# Altium schematic sheet Sam4S Power Distribution_5.SchDoc: Sam4S Power Distribution
size A4; DrawnBy: Mike Cusdin; Address1: ECE Department; Address2: University of Canterbury; Address3: Christchurch 8041; Address4: New Zealand; Revision: 2; SheetNumber: 2; SheetTotal: 2; PageSetup: Record=PageOptions|CenterHorizontal=True|CenterVertical=True|PrintScale=0.97|XCorrection=1.00|YCorrection=1.00|PrintKind=0|BorderSize=5000000|LeftOffset=0|BottomOffset=0|Orientation=2|PaperLength=1000|PaperWidth=1000|Scale=100|PaperSource=7|PrintQuality=-3|MediaType=1|DitherType=10|PrintScaleMode=1|PaperKind=A4 (210 x 297 mm)|PaperIndex=9
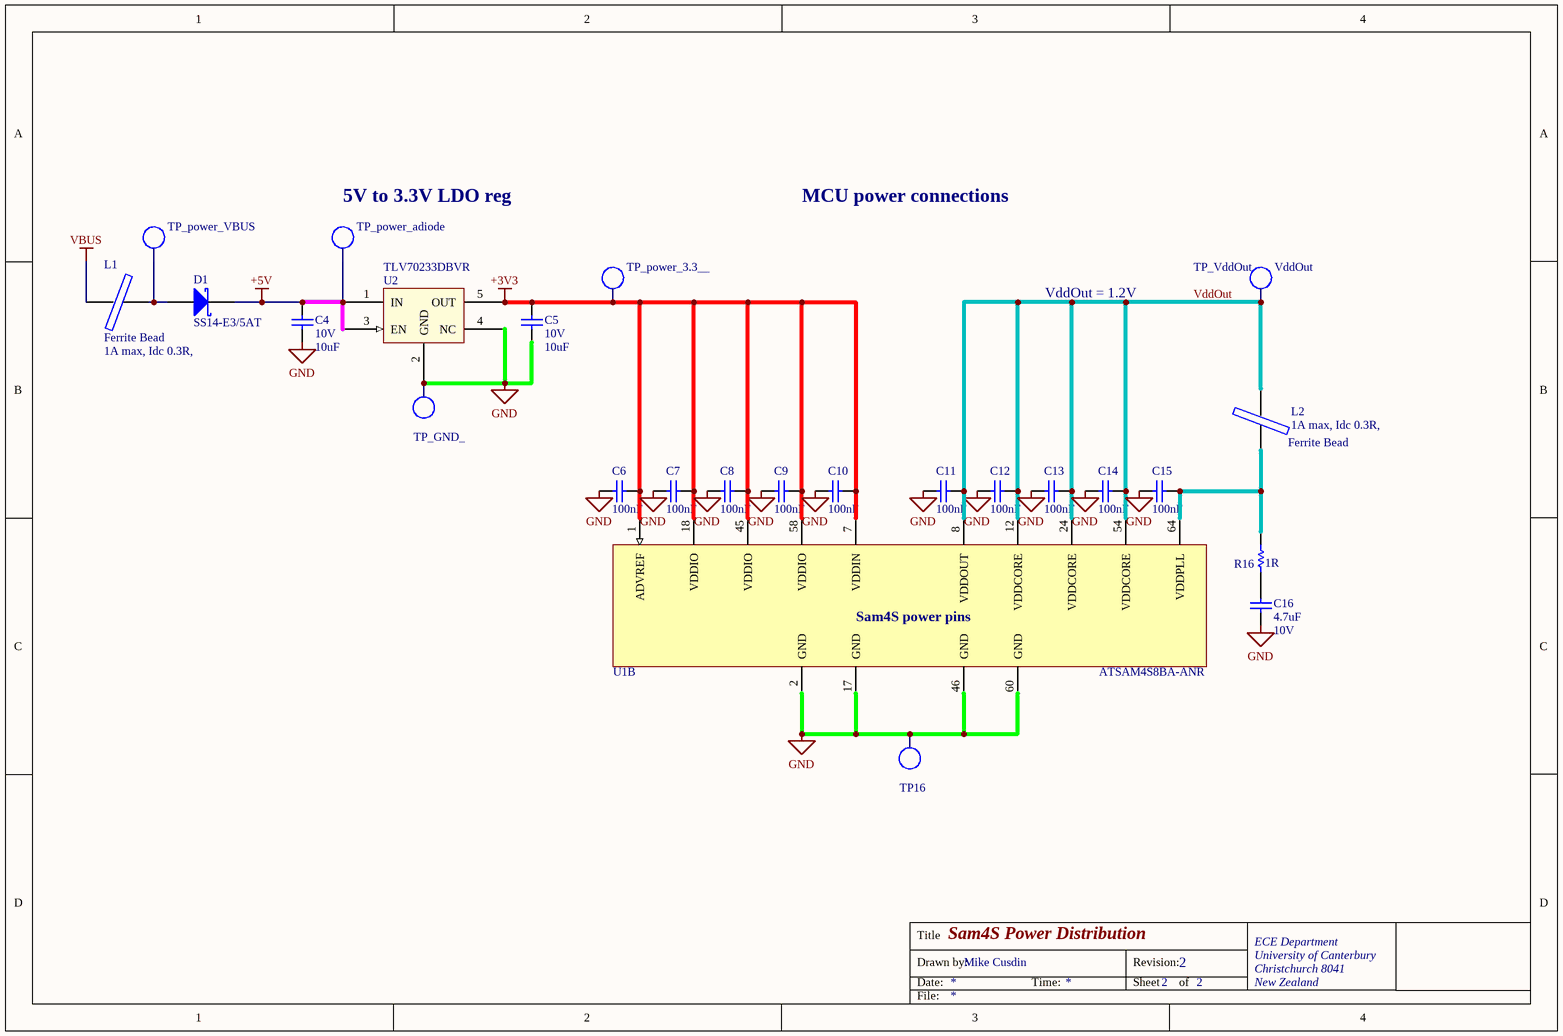
[diagram p0: Sam4S Power Distribution_5.SchDoc]

## Parts
C4  Voltage - Rated: 10V  [CAPC1608L]  (hidden comment: 10uF)
C5  Voltage - Rated: 10V  [CAPC1608L]  (hidden comment: 10uF)
C6  100nF  [CAPC1608L]
C7  100nF  [CAPC1608L]
C8  100nF  [CAPC1608L]
C9  100nF  [CAPC1608L]
C10  100nF  [CAPC1608L]
C11  100nF  [CAPC1608L]
C12  100nF  [CAPC1608L]
C13  100nF  [CAPC1608L]
C14  100nF  [CAPC1608L]
C15  100nF  [CAPC1608L]
C16  Max Voltage: 10V  [CAPC1608N]  (hidden comment: 4.7uF)
D1  SS14-E3/5AT  [DIOM4227X23N]
L1  Ferrite Bead  value 1A max, Idc 0.3R,  [INDC3216L]
L2  Ferrite Bead  value 1A max, Idc 0.3R,  [INDC3216L]
R16  1R  [RESC3216L]
TP16  Gnd  [TP_0805]  (value not drawn)
TP_GND_  Gnd  [TP_0805]  (value not drawn)
TP_power_3.3__  3V3  [TP_0805]  (value not drawn)
TP_power_adiode  3V3  [TP_0805]  (value not drawn)
TP_power_VBUS  3V3  [TP_0805]  (value not drawn)
TP_VddOut  VddOut  [TP_0805]
U1  ATSAM4S8BA-ANR  [LQFP64_L]  (part B of 2)
U2  TLV70233DBVR  [SOT95P280X145-5N]

## Nets
+3V3: C5.1 C6.2 C7.2 C8.2 C9.2 C10.2 TP_power_3.3__.1(TP) U1.1(ADVREF) U1.7(VDDIN) U1.18(VDDIO) U1.45(VDDIO) U1.58(VDDIO) U2.5(OUT)
+5V: C4.1 D1.1(K) TP_power_adiode.1(TP) U2.1(IN) U2.3(EN)
GND: C4.2 C5.2 C6.1 C7.1 C8.1 C9.1 C10.1 C11.1 C12.1 C13.1 C14.1 C15.1 C16.1 TP16.1(TP) TP_GND_.1(TP) U1.2(GND) U1.17(GND) U1.46(GND) U1.60(GND) U2.2(GND) U2.4(NC)
VBUS: L1.2
VddOut: C11.2 C12.2 C13.2 C14.2 L2.2 TP_VddOut.1(TP) U1.8(VDDOUT) U1.12(VDDCORE) U1.24(VDDCORE) U1.54(VDDCORE)
NetC15_2: C15.2 L2.1 R16.2 U1.64(VDDPLL)
NetC16_2: C16.2 R16.1
NetD1_2: D1.2(A) L1.1 TP_power_VBUS.1(TP)

## Notes on the sheet
- (near TP_power_adiode) 5V to 3.3V LDO reg
- MCU power connections
- VddOut = 1.2V
- (near U1) Sam4S power pins
- Title
- Drawn by:
- Date:
- Time:
- Revision:
- Sheet
- of
- File:

## Library data of the parts
C4 C5 = CC_10uF_0603: CAP CER 10UF X5R +-20% 10V 0603; Supplier: ECE Dept; Storage Location: PCB Assembly WS; Value: 10uF
C6-C15 = CC_100nF_0603: CAP CER 100nF X7R +-10% 50V 0603; PackageReference: 0603; Code_IPC: 1608 [0603]; Verify: *; Supplier: ECE Dept; Storage Location: PCB Assembly WS; Value: 100nF
C16 = CC_4.7uF_0603: CAP CER 4.7uF X5R +-20%  10V 0603; Note: Footprint corresponds to dimensions for bulk cassette packaging. This case size has tightened tolerances.; PackageReference: 0805; Code_IPC: 2012[0805]; Verify: *; Supplier: ECE Dept; Storage Location: PCB Assembly WS; Value: 4.7uF
D1 = DS_SS14E3: DIODE, SCHOTTKY, 1A, 40V, DO-214AC; Manufacturer: VISHAY GENERAL SEMICONDUCTOR; Diode Case Style: DO-214; Forward Current If(AV): 1; Diode Type: Schottky; Package / Case: SMA; Supplier 1: Digi-Key; Supplier Part Number 1: SS14-E3/5ATGICT-ND; Supplier 2: Farnell; Supplier Part Number 2: 9551280; Supplier 3: Mouser; Supplier Part Number 3: 625-SS14-E3/11T; Storage Location: PCB Assembly WS; Supplier: ECE Dept; Manufacturer Part Number: SS14-E3/5AT
L1 L2 = IN_Ferrite-Bead: Ferrite Bead, Rdc 0.3R, Z100MHZ 600R, Imax 1A, SMD 1206; Manufacturer: FAIR-RITE; Manufacturer PN: 2512066017Y1; DC Current Rating: 1; DC Resistance Max: 0.08; Ferrite Case Style: 1206 ^3216 Metric]; Frequency Range: 50MHz to 1; Impedance: 600; Impedance Tolerance: ± 25%; Supplier: ECE Dept; Storage Location: PCB Assembly WS; Ferrite Mounting: SMD; Supplier 1: Farnell; Supplier Part Number 1: 1612060; Manufacturer Part Number: 2512066017Y1
R16 = RT_1R: RES 1R OHM 1/4W 5% 1206 SMD; Storage Location: PCB Assembly WS; Supplier: ECE Dept; Value: 1R
TP16 TP_GND_ TP_power_3.3__ TP_power_adiode TP_power_VBUS TP_VddOut = TP_0805: Test Point 2.0X0.9X1.2mm SMD; Manufacturer: TE Connectivity AMP Connectors; Manufacturer Part Number: 1625854-2; Supplier 1: Digi-Key; Mounting Type: Surface Mount; Terminal: 0.079" x 0.049" x 0.057" (2.00mm x 1.25mm x 1.45mm); Type: PC Test Point; Supplier Part Number 1: A106144CT-ND
U1 = SE_ATSAM4S16BA-MU: IC MCU 32BIT 512KB FLASH 64LQFP; Manufacturer: Atmel; Connectivity: I²C, IrDA, Memory Card, SPI, SSC, UART/USART, USB; Core Processor: ARM® Cortex®-M4; Core Size: 32-Bit; Data Converters: A/D 11x12b, D/A 2x12b; Number of I/O: 47; Peripherals: Brown-out Detect/Reset, DMA, POR, PWM, WDT; Program Memory Size: 512KB (512K x 8); RAM Size: 128K x 8; Speed: 120MHz; Voltage - Supply (Vcc/Vdd): 1.62 V ~ 3.6 V; PackageVersion: revJ, Jul-2007; PackageReference: 64PS; PackageDescription: 64-Pin Quad Flat No-Lead (QFN) Sawn, 9 x 9 x 1.0 mm Body, 0.5 mm Pitch, Exposed Pad; Code_JEDEC: MO-220VMMD-3; ComponentLink1Description: Manufacturer URL; ComponentLink1URL: http://www.atmel.com/; ComponentLink2Description: SAM4S Series Datasheet; ComponentLink2URL: http://www.atmel.com/dyn/resources/prod_documents/11100.pdf; ComponentLink3Description: SAM4S Series Summary; ComponentLink3URL: http://www.atmel.com/dyn/resources/prod_documents/11100S.pdf; Supplier 1: Digi-Key; Package / Case: 64-LQFP; Packaging: Cut Tape (CT); Program Memory Type: FLASH; Supplier Part Number 1: ATSAM4S8BA-ANRCT-ND; Manufacturer Part Number: ATSAM4S8BA-ANR
U2 = SV_TLV70233DBVR: IC REG LDO 3.3V 0.3A SOT23-5; Manufacturer: Texas Instruments; Current - Output: 300mA; Supplier 1: Digi-Key; Operating Temperature: -40°C ~ 125°C; Package / Case: SC-74A, SOT-753; Pricing: 1=0.77, 10=0.647, 25=0.5672, 100=0.4853, 250=0.421, 500=0.35658, 750=0.30789, 1000=0.2749 (NZD); Supplier Part Number 1: 296-32415-1-ND; Manufacturer Part Number: TLV70233DBVR